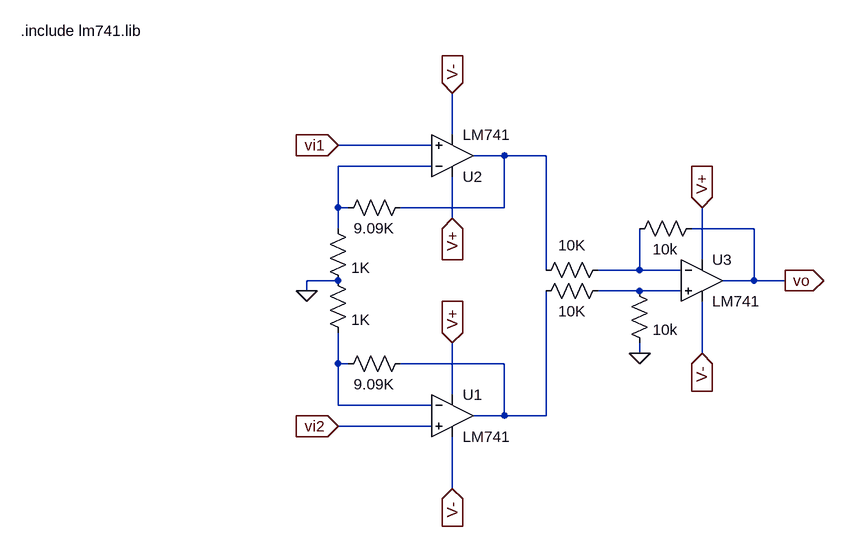
[diagram p0: schematic IA.asc]
IA.asc, the LTspice schematic file:
Version 4.1
SHEET 1 1104 796
WIRE 336 112 336 48
WIRE 304 128 160 128
WIRE 416 144 368 144
WIRE 480 144 416 144
WIRE 304 160 160 160
WIRE 160 224 160 160
WIRE 176 224 160 224
WIRE 416 224 416 144
WIRE 416 224 256 224
WIRE 336 240 336 176
WIRE 160 256 160 224
WIRE 800 256 704 256
WIRE 720 304 720 224
WIRE 480 320 480 144
WIRE 624 320 624 256
WIRE 624 320 560 320
WIRE 688 320 624 320
WIRE 160 336 112 336
WIRE 800 336 800 256
WIRE 800 336 752 336
WIRE 848 336 800 336
WIRE 112 352 112 336
WIRE 624 352 560 352
WIRE 688 352 624 352
WIRE 624 448 624 432
WIRE 720 448 720 368
WIRE 160 464 160 416
WIRE 176 464 160 464
WIRE 416 464 256 464
WIRE 336 512 336 432
WIRE 160 528 160 464
WIRE 304 528 160 528
WIRE 416 544 416 464
WIRE 416 544 368 544
WIRE 480 544 480 352
WIRE 480 544 416 544
WIRE 304 560 160 560
WIRE 336 656 336 576
FLAG 336 432 V+
IOPIN 336 432 In
FLAG 336 48 V-
IOPIN 336 48 In
FLAG 336 240 V+
IOPIN 336 240 In
FLAG 336 656 V-
IOPIN 336 656 In
FLAG 720 224 V+
IOPIN 720 224 In
FLAG 720 448 V-
IOPIN 720 448 In
FLAG 112 352 0
FLAG 624 448 0
FLAG 848 336 vo
IOPIN 848 336 Out
FLAG 160 128 vi1
IOPIN 160 128 In
FLAG 160 560 vi2
IOPIN 160 560 In
SYMBOL OpAmps\\opamp2 336 480 R0
SYMATTR InstName U1
SYMATTR Value LM741
SYMBOL OpAmps\\opamp2 336 208 M180
SYMATTR InstName U2
SYMATTR Value LM741
SYMBOL OpAmps\\opamp2 720 272 R0
SYMATTR InstName U3
SYMATTR Value LM741
SYMBOL res 272 208 R90
WINDOW 0 0 56 Invisible 2
WINDOW 3 32 56 VTop 2
SYMATTR InstName R1
SYMATTR Value 9.09K
SYMBOL res 272 448 R90
WINDOW 0 0 56 Invisible 2
WINDOW 3 32 56 VTop 2
SYMATTR InstName R2
SYMATTR Value 9.09K
SYMBOL res 144 240 R0
WINDOW 0 36 40 Invisible 2
SYMATTR InstName R3
SYMATTR Value 1K
SYMBOL res 144 320 R0
WINDOW 0 36 40 Invisible 2
SYMATTR InstName R4
SYMATTR Value 1K
SYMBOL res 576 304 R90
WINDOW 0 0 56 Invisible 2
WINDOW 3 -38 56 VTop 2
SYMATTR InstName R5
SYMATTR Value 10K
SYMBOL res 576 336 R90
WINDOW 0 0 56 Invisible 2
WINDOW 3 32 56 VTop 2
SYMATTR InstName R6
SYMATTR Value 10K
SYMBOL res 720 240 R90
WINDOW 0 0 56 Invisible 2
WINDOW 3 32 56 VTop 2
SYMATTR InstName R7
SYMATTR Value 10k
SYMBOL res 608 336 R0
WINDOW 0 36 40 Invisible 2
SYMATTR InstName R8
SYMATTR Value 10k
TEXT -328 -48 Left 2 !.include lm741.lib

The netlist it stands for:
* IA.asc
X§U1 vi2 N005 V+ V- N006 LM741  ; pins In+ In- V+ V- OUT
X§U2 vi1 N002 V+ V- N001 LM741  ; pins In+ In- V+ V- OUT
X§U3 N004 N003 V+ V- vo LM741  ; pins In+ In- V+ V- OUT
R1 N001 N002 9.09K
R2 N006 N005 9.09K
R3 N002 0 1K
R4 0 N005 1K
R5 N003 N001 10K
R6 N004 N006 10K
R7 vo N003 10k
R8 N004 0 10k
.include lm741.lib
.backanno
.end